# EAGLE schematic aMazeGarden schematic (EAGLE 9.3.2)
CNAME: Solar charger; CREVISION: 1/1; DESIGNER: RoboMaze group
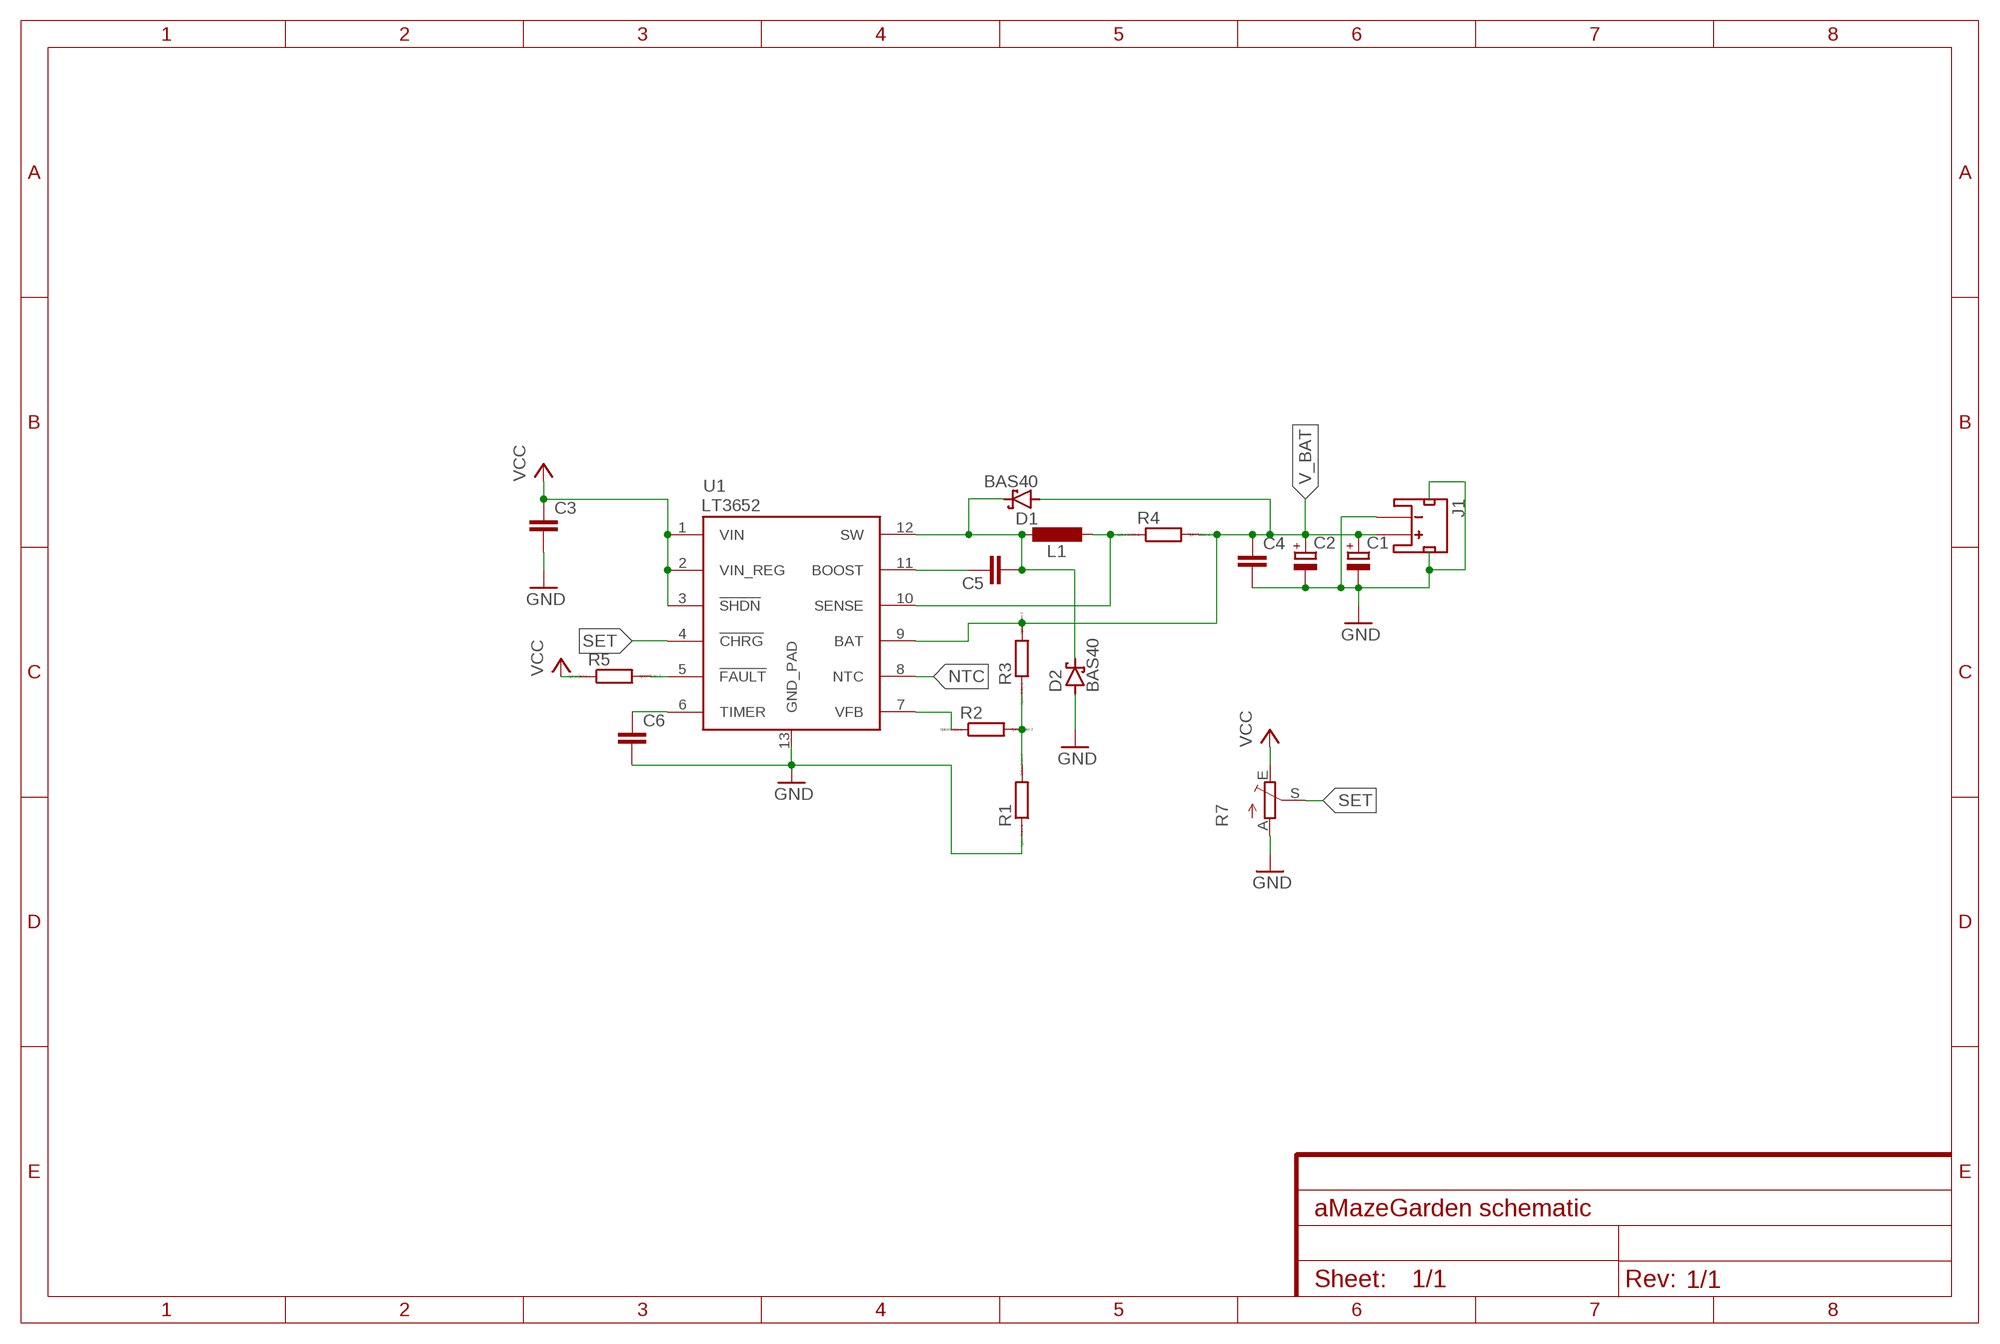
[diagram p0: schematic, sheet 1]

## Parts
C1  CPOL-EU085CS-1AR  [085CS_1AR]
C2  CPOL-EU085CS-1AR  [085CS_1AR]
C3  C-EUC0805  [C0805]
C4  C-EUC0805  [C0805]
C5  C-EUC0805  [C0805]
C6  C-EUC0805  [C0805]
D1  BAS40  [SOT23]
D2  BAS40  [SOT23]
J1  JST_2MM_MALE  [JST-2-SMD]
L1  L-EUPIS2816  [PIS2816]
R1  R  [R0805]
R2  R  [R0805]
R3  R  [R0805]
R4  R  [R0805]
R5  R  [R0805]
R7  TRIM_EU-B25P  [B25P]
U1  LT3652  [MSOP-12_GND]

## Nets
GND: C1.- C2.- C3.2 C4.2 C6.2 D2.1(A) J1.1(-) J1.NC1(PAD1) J1.NC2(PAD2) R1.1 R7.A U1.13(GND_PAD)
N$1: C6.1 U1.6(TIMER)
N$2: R1.2 R2.2 R3.1
N$3: R2.1 U1.7(VFB)
N$4: R5.2 U1.5(!FAULT)
N$5: L1.2 R4.1 U1.10(SENSE)
N$6: C5.2 D1.3(C) D2.3(C) L1.1 U1.12(SW)
N$7: C5.1 U1.11(BOOST)
NTC: U1.8(NTC)
SET: R7.S U1.4(!CHRG)
V_BAT: C1.+ C2.+ C4.1 D1.1(A) J1.2(+) R3.2 R4.2 U1.9(BAT)
VCC: C3.1 R5.1 R7.E U1.1(VIN) U1.2(VIN_REG) U1.3(!SHDN)

## Library data of the parts
C1 C2 = resistor:CPOL-EU: POLARIZED CAPACITOR, European symbol
C3-C6 = resistor:C-EU: CAPACITOR, European symbol
D1 D2 = diode:BAS40: Silicon Schottky Diodes General-purpose diode for high-speed switching
J1 = SparkFun-Connectors:JST_2MM_MALE: JST 2MM MALE RA CONNECTOR Two pin, compact surface mount connector. Commonly used as a battery input connection point. We really like the solid locking feeling and high current rating on these small connectors. We use these all the time as battery connectors. Mates to single-cell LiPo batteries. Here is the connector we sell at SparkFun: JST Right Angle Connector - White <https://www.sparkfun.com/products/8612> (PRT-08612) Datasheet <http://www.sparkfun.com/datasheets/Prototyping/Connectors/JST-Horizontal.pdf> It was used on these SparkFun products: SparkFun MOSFET Power Controller <https://www.sparkfun.com/products/11214> (PRT-11214) SparkFun Battery Babysitter - LiPo Battery Manager <https://www.sparkfun.com/products/13777> (PRT-13777) And many, many others that required a lipo battery connection.; PROD_ID: CONN-11443; SF_ID: PRT-08612
L1 = rcl:L-EU: INDUCTOR, European symbol; SPICEPREFIX: L
R1-R5 = eagle-ltspice:R: RESISTOR, European symbol; SPICEMODEL: NONE; SPICEPREFIX: R
R7 = pot:TRIM_EU-: POTENTIOMETER
U1 = SparkFun-IC-Power:LT3652: LT3652 MPPT Solar Charge Controller(IC-11822) 5V-32V smart charger for batteries up to 14.4V